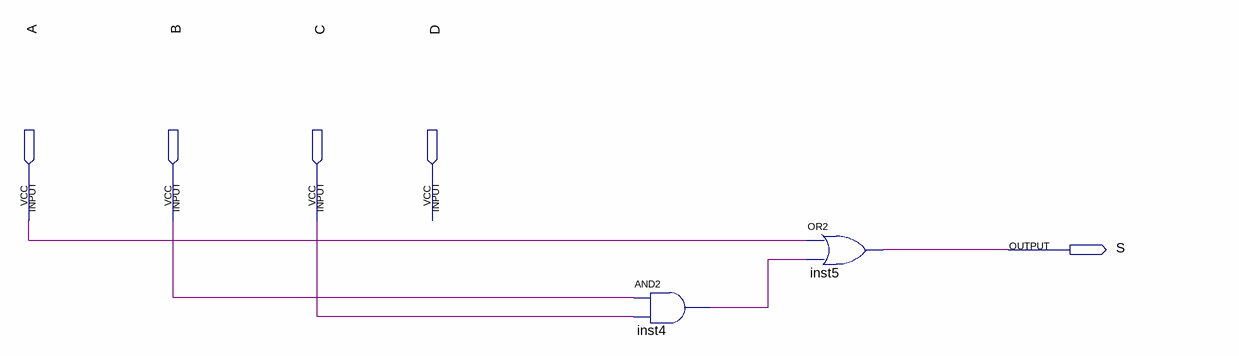
[diagram p0: schematic sheet]
// Quartus schematic lab2_part1.bdf as structural Verilog: 2 symbols, 5 pins
module lab2_part1 (
  input  A,
  input  B,
  input  C,
  input  D,
  output S
);

  wire inst4_out;

  and inst4 (inst4_out, B, C);
  or inst5 (S, A, inst4_out);
endmodule
